# Altium schematic sheet ConnectorInterface.SchDoc
size 215 x 279 mm; SheetNumber: 2; SheetTotal: 6
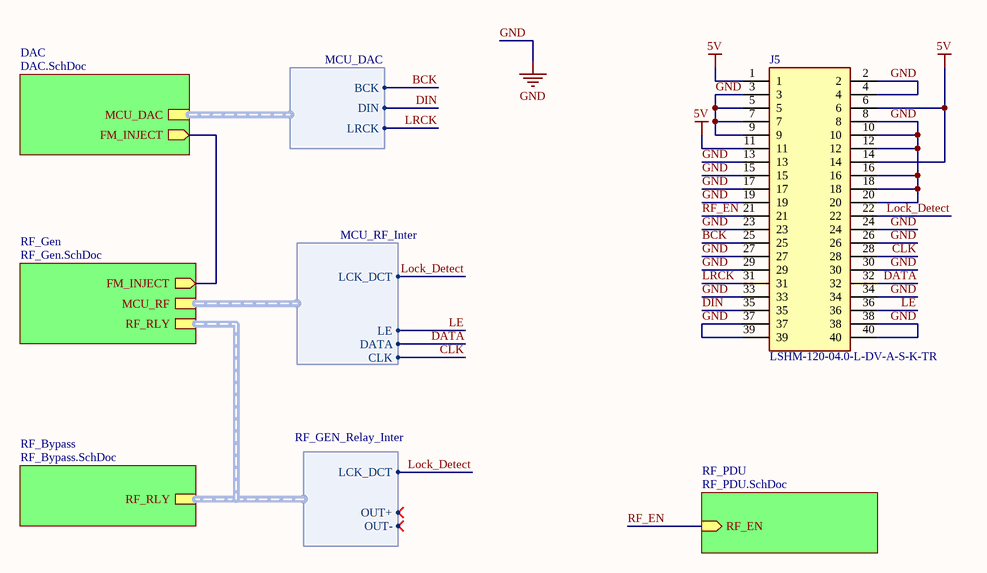
[diagram p0: ConnectorInterface.SchDoc]

## Parts
J5  LSHM-120-04.0-L-DV-A-S-K-TR  [LSHM-120-XX.X-YYY-DV-A-S-K-TR]

## Sub-sheets
DAC = DAC.SchDoc: FM_INJECT (out), MCU_DAC (harness MCU_DAC)
RF_Bypass = RF_Bypass.SchDoc: RF_RLY (harness RF_GEN_Relay_Inter)
RF_Gen = RF_Gen.SchDoc: MCU_RF (harness MCU_RF_Inter), FM_INJECT (out), RF_RLY (harness RF_GEN_Relay_Inter)
RF_PDU = RF_PDU.SchDoc: RF_EN (in)

## Harnesses
MCU_RF_Inter: LCK_DCT, LE, DATA, CLK
MCU_DAC: BCK, DIN, LRCK
RF_GEN_Relay_Inter: LCK_DCT, OUT+, OUT-

## Nets
5V: J5.1 J5.6 J5.11 J5.14
GND: J5.2 J5.3 J5.4 J5.5 J5.7 J5.8 J5.9 J5.10 J5.12 J5.13 J5.15 J5.16 J5.17 J5.18 J5.19 J5.20 J5.23 J5.24 J5.26 J5.27 J5.29 J5.30 J5.33 J5.34 J5.37 J5.38 J5.39 J5.40
BCK: J5.25 ; sheet DAC/MCU_DAC.BCK
CLK: J5.28 ; sheet RF_Gen/MCU_RF.CLK
DATA: J5.32 ; sheet RF_Gen/MCU_RF.DATA
DIN: J5.35 ; sheet DAC/MCU_DAC.DIN
LE: J5.36 ; sheet RF_Gen/MCU_RF.LE
Lock_Detect: J5.22 ; sheet RF_Gen/MCU_RF.LCK_DCT, sheet RF_Bypass/RF_RLY.LCK_DCT
LRCK: J5.31 ; sheet DAC/MCU_DAC.LRCK
RF_EN: J5.21 ; sheet RF_PDU/RF_EN
(unnamed): sheet RF_Gen/FM_INJECT, sheet DAC/FM_INJECT

## Buses and harness runs
harness sheet RF_Bypass/RF_RLY = sheet RF_Gen/RF_RLY

## Notes on the sheet
- Contents
- Revision Notes

## Library data of the parts
J5 = LSHM-120-04.0-L-DV-A-S-K-TR: Connector; Manufacturer_Name: SAMTEC; Datasheet Link: http://suddendocs.samtec.com/prints/lshm-1xx-xx.x-xxx-dv-a-x-x-xx-mkt.pdf; Manufacturer_Part_Number: LSHM-120-04.0-L-DV-A-S-K-TR; Mouser Part Number: 200-LSHM12004LDVASK; Mouser Price/Stock: https://www.mouser.co.uk/ProductDetail/Samtec/LSHM-120-040-L-DV-A-S-K-TR?qs=PB6%2FjmICvI1v5WBlLc04lg%3D%3D; Arrow Part Number: LSHM-120-04.0-L-DV-A-S-K-TR; Arrow Price/Stock: https://www.arrow.com/en/products/lshm-120-04.0-l-dv-a-sktr/samtec?region=nac